# Altium schematic sheet Sheet4_LCD.SchDoc
size A4; Organization: Altium Limited; Address1: 3 Minna Close; Address2: Belrose; Address3: NSW 2085; Address4: Australia
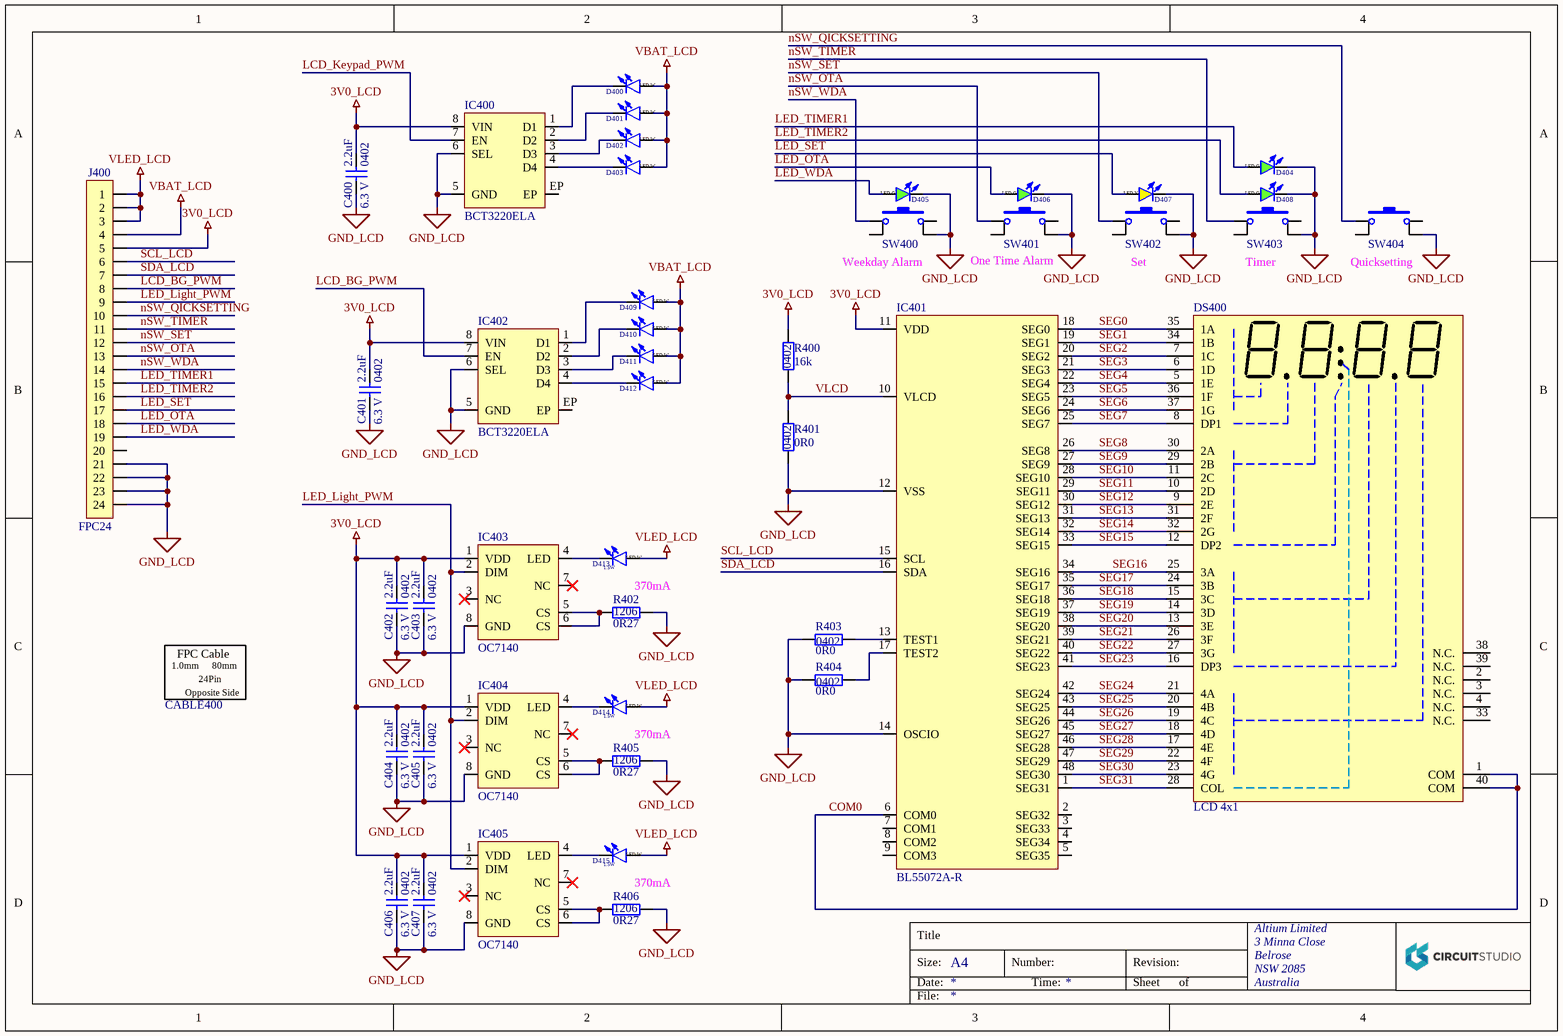
[diagram p0: Sheet4_LCD.SchDoc]

## Parts
C400  Capacitance: 2.2uF  Footprint: 0402  Voltage: 6.3 V  [C_0402]  (hidden comment: C 2.2uF 0402 6.3V)
C401  Capacitance: 2.2uF  Footprint: 0402  Voltage: 6.3 V  [C_0402]  (hidden comment: C 2.2uF 0402 6.3V)
C402  Capacitance: 2.2uF  Footprint: 0402  Voltage: 6.3 V  [C_0402]  (hidden comment: C 2.2uF 0402 6.3V)
C403  Capacitance: 2.2uF  Footprint: 0402  Voltage: 6.3 V  [C_0402]  (hidden comment: C 2.2uF 0402 6.3V)
C404  Capacitance: 2.2uF  Footprint: 0402  Voltage: 6.3 V  [C_0402]  (hidden comment: C 2.2uF 0402 6.3V)
C405  Capacitance: 2.2uF  Footprint: 0402  Voltage: 6.3 V  [C_0402]  (hidden comment: C 2.2uF 0402 6.3V)
C406  Capacitance: 2.2uF  Footprint: 0402  Voltage: 6.3 V  [C_0402]  (hidden comment: C 2.2uF 0402 6.3V)
C407  Capacitance: 2.2uF  Footprint: 0402  Voltage: 6.3 V  [C_0402]  (hidden comment: C 2.2uF 0402 6.3V)
CABLE400  Pitch: 1.0mm  Length: 80mm  Mode: Opposite Side  NoOfPins: 24Pin  (hidden comment: FPC24p80mm)
D400  LED W  [LED_99-218UMC_side]
D401  LED W  [LED_99-218UMC_side]
D402  LED W  [LED_99-218UMC_side]
D403  LED W  [LED_99-218UMC_side]
D404  LED G  [LED_0603]
D405  LED G  [LED_0603]
D406  LED G  [LED_0603]
D407  LED Y  [LED_0603]
D408  LED G  [LED_0603]
D409  LED W  [LED_99-218UMC_side]
D410  LED W  [LED_99-218UMC_side]
D411  LED W  [LED_99-218UMC_side]
D412  LED W  [LED_99-218UMC_side]
D413  LED W  Power: 1.5W  [LED_3.5x3.15]
D414  LED W  Power: 1.5W  [LED_3.5x3.15]
D415  LED W  Power: 1.5W  [LED_3.5x3.15]
DS400  LCD 4x1  [DISPL_7SEG_4]
IC400  BCT3220ELA  [VDFN-8-EP_2x2]
IC401  BL55072A-R  [TSSOP-48]
IC402  BCT3220ELA  [VDFN-8-EP_2x2]
IC403  OC7140  [SOIC-8-EP]
IC404  OC7140  [SOIC-8-EP]
IC405  OC7140  [SOIC-8-EP]
J400  FPC24  [J_FPC_522712479]
R400  Resistance: 16k  Footprint: 0402  [R_0402]  (hidden comment: R 16k 0402)
R401  Resistance: 0R0  Footprint: 0402  [R_0402]  (hidden comment: R 0R0 0402)
R402  Resistance: 0R27  Footprint: 1206  [R_1206]  (hidden comment: R 0R27 1206)
R403  Resistance: 0R0  Footprint: 0402  [R_0402]  (hidden comment: R 0R0 0402)
R404  Resistance: 0R0  Footprint: 0402  [R_0402]  (hidden comment: R 0R0 0402)
R405  Resistance: 0R27  Footprint: 1206  [R_1206]  (hidden comment: R 0R27 1206)
R406  Resistance: 0R27  Footprint: 1206  [R_1206]  (hidden comment: R 0R27 1206)
SW400  SW  [SW_BRIGHT_6.1x6.1]  (value not drawn)
SW401  SW  [SW_BRIGHT_6.1x6.1]  (value not drawn)
SW402  SW  [SW_BRIGHT_6.1x6.1]  (value not drawn)
SW403  SW  [SW_BRIGHT_6.1x6.1]  (value not drawn)
SW404  SW  [SW_BRIGHT_6.1x6.1]  (value not drawn)

## Nets
3V0_LCD: C400.2 C401.2 C402.2 C403.2 C404.2 C405.2 C406.2 C407.2 IC400.8(VIN) IC401.11(VDD) IC402.8(VIN) IC403.1(VDD) IC404.1(VDD) IC405.1(VDD) J400.5 R400.2
GND_LCD: C400.1 C401.1 C402.1 C403.1 C404.1 C405.1 C406.1 C407.1 D404.K D405.K D406.K D407.K D408.K IC400.5(GND) IC400.6(SEL) IC401.12(VSS) IC401.14(OSCIO) IC402.5(GND) IC402.6(SEL) IC403.8(GND) IC404.8(GND) IC405.8(GND) J400.21 J400.22 J400.23 J400.24 R401.1 R402.2 R403.2 R404.2 R405.2 R406.2 SW400.4 SW401.4 SW402.4 SW403.4 SW404.4
VBAT_LCD: D400.2(A) D401.2(A) D402.2(A) D403.2(A) D409.2(A) D410.2(A) D411.2(A) D412.2(A) J400.4
VLED_LCD: D413.A D414.A D415.A J400.1 J400.2 J400.3
COM0: DS400.1(COM) DS400.40(COM) IC401.6(COM0)
LCD_BG_PWM: IC402.7(EN) J400.8
LCD_Keypad_PWM: IC400.7(EN)
LED_Light_PWM: IC403.2(DIM) IC404.2(DIM) IC405.2(DIM) J400.9
LED_OTA: D406.A J400.18
LED_SET: D407.A J400.17
LED_TIMER1: D404.A J400.15
LED_TIMER2: D408.A J400.16
LED_WDA: D405.A J400.19
nSW_OTA: J400.13 SW401.1
nSW_QICKSETTING: J400.10 SW404.1
nSW_SET: J400.12 SW402.1
nSW_TIMER: J400.11 SW403.1
nSW_WDA: J400.14 SW400.1
SCL_LCD: IC401.15(SCL) J400.6
SDA_LCD: IC401.16(SDA) J400.7
SEG0: DS400.35(1A) IC401.18(SEG0)
SEG1: DS400.34(1B) IC401.19(SEG1)
SEG2: DS400.7(1C) IC401.20(SEG2)
SEG3: DS400.6(1D) IC401.21(SEG3)
SEG4: DS400.5(1E) IC401.22(SEG4)
SEG5: DS400.36(1F) IC401.23(SEG5)
SEG6: DS400.37(1G) IC401.24(SEG6)
SEG7: DS400.8(DP1) IC401.25(SEG7)
SEG8: DS400.30(2A) IC401.26(SEG8)
SEG9: DS400.29(2B) IC401.27(SEG9)
SEG10: DS400.11(2C) IC401.28(SEG10)
SEG11: DS400.10(2D) IC401.29(SEG11)
SEG12: DS400.9(2E) IC401.30(SEG12)
SEG13: DS400.31(2F) IC401.31(SEG13)
SEG14: DS400.32(2G) IC401.32(SEG14)
SEG15: DS400.12(DP2) IC401.33(SEG15)
SEG16: DS400.25(3A) IC401.34(SEG16)
SEG17: DS400.24(3B) IC401.35(SEG17)
SEG18: DS400.15(3C) IC401.36(SEG18)
SEG19: DS400.14(3D) IC401.37(SEG19)
SEG20: DS400.13(3E) IC401.38(SEG20)
SEG21: DS400.26(3F) IC401.39(SEG21)
SEG22: DS400.27(3G) IC401.40(SEG22)
SEG23: DS400.16(DP3) IC401.41(SEG23)
SEG24: DS400.21(4A) IC401.42(SEG24)
SEG25: DS400.20(4B) IC401.43(SEG25)
SEG26: DS400.19(4C) IC401.44(SEG26)
SEG27: DS400.18(4D) IC401.45(SEG27)
SEG28: DS400.17(4E) IC401.46(SEG28)
SEG29: DS400.22(4F) IC401.47(SEG29)
SEG30: DS400.23(4G) IC401.48(SEG30)
SEG31: DS400.28(COL) IC401.1(SEG31)
VLCD: IC401.10(VLCD) R400.1 R401.2
NetD400_1: D400.1(K) IC400.1(D1)
NetD401_1: D401.1(K) IC400.2(D2)
NetD402_1: D402.1(K) IC400.3(D3)
NetD403_1: D403.1(K) IC400.4(D4)
NetD409_1: D409.1(K) IC402.1(D1)
NetD410_1: D410.1(K) IC402.2(D2)
NetD411_1: D411.1(K) IC402.3(D3)
NetD412_1: D412.1(K) IC402.4(D4)
NetD413_K: D413.K IC403.4(LED)
NetD414_K: D414.K IC404.4(LED)
NetD415_K: D415.K IC405.4(LED)
NetIC401_13: IC401.13(TEST1) R403.1
NetIC401_17: IC401.17(TEST2) R404.1
NetIC403_5: IC403.5(CS) IC403.6(CS) R402.1
NetIC404_5: IC404.5(CS) IC404.6(CS) R405.1
NetIC405_5: IC405.5(CS) IC405.6(CS) R406.1

Not connected (* = marked no-connect by the designer): DS400 2(N.C.) 3(N.C.) 4(N.C.) 33(N.C.) 38(N.C.) 39(N.C.); IC400 EP; IC401 2(SEG32) 3(SEG33) 4(SEG34) 5(SEG35) 7(COM1) 8(COM2) 9(COM3); IC402 EP; IC403 3(NC)* 7(NC)*; IC404 3(NC)* 7(NC)*; IC405 3(NC)* 7(NC)*; J400 20; SW400 2 3; SW401 2 3; SW402 2 3; SW403 2 3; SW404 2 3

## Notes on the sheet
- (near SW400) Weekday Alarm
- (near SW401) One Time Alarm
- (near SW402) Set
- (near SW403) Timer
- (near SW404) Quicksetting
- 370mA
- Title
- Size:
- Date:
- A4
- Number:
- Time:
- Revision:
- Sheet
- of
- File:
- (in symbol CABLE_FPC24_80) FPC Cable

## Library data of the parts
C400-C407 = CAP_2.2uF_6V3_0402: CAP CER 2.2UF 6.3V X6T 0402; Manufacturer: Murata Electronics; Manufacturer Part Number: GRM155D80J225ME95D; Type: Capacitor; Supplier 1: Digi-Key; Supplier Part Number 1: 490-10450-1-ND
CABLE400 = CABLE_FPC24_80: FPC Cable 1mm Pitch 24Pin 80mm Opposite Sides; Manufacturer: LX; Manufacturer Part Number: C50299; Type: other; Supplier 1: LCSC; Supplier Part Number 1: C50299
D400-D403 D409-D412 = D_LED_White_s: LED WHITE SIDE SMD; Manufacturer: Everlight Elec; Manufacturer Part Number: 99-218UMC/1637CD/TR8-T; Type: Diode, LED; Supplier 1: JLCPCB; Supplier Part Number 1: C710226
D404-D406 D408 = D_LED_Green_0603: LED GREEN DIFFUSED 0603 SMD; Manufacturer: OSRAM Opto Semiconductors Inc.; Manufacturer Part Number: LT Q39G-Q1OO-25-1; Type: Diode, LED; Supplier 1: Digi-Key; Supplier Part Number 1: 475-3442-1-ND
D407 = D_LED_Yellow_0603: LED YELLOW DIFFUSED; Manufacturer: Stanley Electric Co; Manufacturer Part Number: FKY1111C-TR; Type: Diode, LED; Supplier 1: Digi-Key; Supplier Part Number 1: 404-1273-1-ND
D413-D415 = D_LED_W_HP: LED XLAMP WARM WHITE 3250K 4SMD; Manufacturer: CreeLED, Inc.; Manufacturer Part Number: MLEAWT-A1-0000-0003F7; Type: Diode, LED; Supplier 1: Digi-Key; Supplier Part Number 1: MLEAWT-A1-0000-0003F7CT-ND
DS400 = DISPL_7SEG_4x1: LCD MOD 4 DIG 4 X 1 REFLECTIVE; Manufacturer: Varitronix; Manufacturer Part Number: VI-402-DP-RC-S; Type: other, Display; Supplier 1: Digi-Key; Supplier Part Number 1: 153-1135-ND
IC400 IC402 = IC_LED_cntr_BCT3220ELA: IC LED DRIVER 4 CH; Manufacturer: BROADCHIP; Manufacturer Part Number: BCT3220ELA-TR; Type: IC, Driver; Supplier 1: JLCPCB; Supplier Part Number 1: C239191
IC401 = IC_LCD_cntr_BL55072A-R: IC LCD DRIVER 36SEG TSSOP-48; Manufacturer: BL(Shanghai Belling); Manufacturer Part Number: BL55072A-R; Type: IC, Driver; Supplier 1: JLCPCB; Supplier Part Number 1: C524044
IC403-IC405 = IC_LED_cntr_OC7140: IC LED DRIVER 1 CH 2A ESOP8; Manufacturer: OCX; Manufacturer Part Number: OC7140; Type: IC, Driver; Supplier 1: JLCPCB; Supplier Part Number 1: C842736
J400 = J_FPC24_DS: CONN FPC BOT 24 PIN 1mm Pitch; Manufacturer: MOLEX; Manufacturer Part Number: 522712479; Pitch: 1.0; Type: Connector; Supplier 1: LCSC; Supplier Part Number 1: C293627; Pins: 24
R400 = R_16k_0402: RES 16K OHM 1% 1/16W 0402; Manufacturer: Stackpole Electronics Inc; Manufacturer Part Number: RMCF0402FT16K0; Type: Resistor; Supplier 1: Digi-Key; Supplier Part Number 1: RMCF0402FT16K0CT-ND
R401 R403 R404 = R_0R0_0402: RES 0 OHM JUMPER 1/16W 0402; Manufacturer: Stackpole Electronics Inc; Manufacturer Part Number: RMCF0402ZT0R00; Type: Resistor; Supplier 1: Digi-Key; Supplier Part Number 1: RMCF0402ZT0R00CT-ND
R402 R405 R406 = R_0R27_1206: RES 0.27 OHM 1% 1/3W 1206; Manufacturer: RALEC; Manufacturer Part Number: RTT06R270FTP; Type: Resistor; Supplier 1: JLCPCB; Supplier Part Number 1: C104939
SW400-SW404 = SW_TactileSW_V_2: SWITCH TACTILE SW-SMD; Manufacturer: BRIGHT; Manufacturer Part Number: TSA063G50-250; Type: other; Supplier 1: LCSC; Supplier Part Number 1: C294565